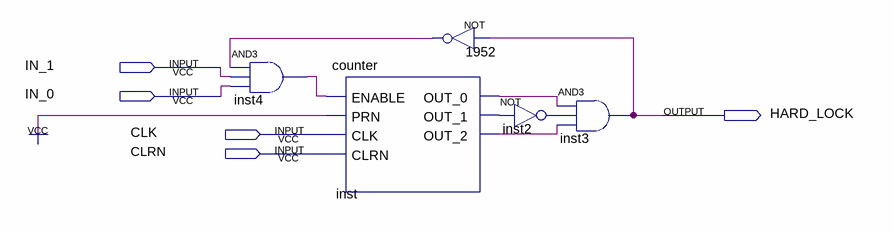
[diagram p0: schematic sheet]
// Quartus schematic H_Lock.bdf as structural Verilog: 5 symbols, 5 pins
module H_Lock (
  input  IN_1,
  input  IN_0,
  input  CLK,
  input  CLRN,
  output HARD_LOCK
);

  wire inst2_out, inst4_out, inst_out_0, inst_out_1, inst_out_2, n1952_out;

  and inst4 (inst4_out, n1952_out, IN_1, IN_0);
  counter inst (
    .ENABLE(inst4_out), .PRN(1'b1), .CLK(CLK), .CLRN(CLRN), .OUT_0(inst_out_0), .OUT_1(inst_out_1),
    .OUT_2(inst_out_2));
  not u_1952 (n1952_out, HARD_LOCK);
  not inst2 (inst2_out, inst_out_1);
  and inst3 (HARD_LOCK, inst_out_0, inst2_out, inst_out_2);
endmodule
